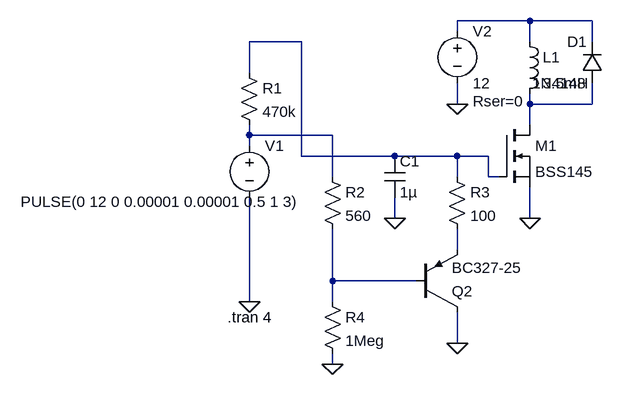
[diagram p0: schematic Draft2.asc]
Draft2.asc, the LTspice schematic file:
Version 4
SHEET 1 880 740
WIRE 288 192 176 192
WIRE 384 192 288 192
WIRE 176 208 176 192
WIRE -64 224 -144 224
WIRE 288 224 288 192
WIRE 384 224 384 192
WIRE -144 272 -144 224
WIRE 176 320 176 288
WIRE 288 320 288 304
WIRE 384 320 384 288
WIRE 384 320 288 320
WIRE 288 352 288 320
WIRE -144 368 -144 352
WIRE -16 368 -144 368
WIRE -144 384 -144 368
WIRE -64 400 -64 224
WIRE 80 400 -64 400
WIRE 176 400 80 400
WIRE 224 400 176 400
WIRE -16 432 -16 368
WIRE 176 432 176 400
WIRE 224 432 224 400
WIRE 240 432 224 432
WIRE 80 496 80 464
WIRE 288 496 288 448
WIRE 176 544 176 512
WIRE -16 592 -16 512
WIRE 112 592 -16 592
WIRE -144 624 -144 464
WIRE -16 624 -16 592
WIRE 176 688 176 640
WIRE -16 720 -16 704
FLAG 288 496 0
FLAG -144 624 0
FLAG 176 320 0
FLAG 80 496 0
FLAG 176 688 0
FLAG -16 720 0
SYMBOL ind 272 208 R0
SYMATTR InstName L1
SYMATTR Value 3.5mH
SYMATTR SpiceLine Rser=580
SYMBOL diode 400 288 R180
WINDOW 0 24 64 Left 2
WINDOW 3 24 0 Left 2
SYMATTR InstName D1
SYMATTR Value 1N4148
SYMBOL voltage -144 368 R0
WINDOW 3 -352 102 Left 2
WINDOW 123 0 0 Left 0
WINDOW 39 0 0 Left 0
SYMATTR InstName V1
SYMATTR Value PULSE(0 12 0 0.00001 0.00001 0.5 1 3)
SYMBOL voltage 176 192 R0
WINDOW 123 0 0 Left 0
WINDOW 39 24 124 Left 2
SYMATTR InstName V2
SYMATTR Value 12
SYMATTR SpiceLine Rser=0
SYMBOL cap 64 400 R0
SYMATTR InstName C1
SYMATTR Value 1µ
SYMBOL res -160 256 R0
SYMATTR InstName R1
SYMATTR Value 470k
SYMBOL pnp 112 640 M180
SYMATTR InstName Q2
SYMATTR Value BC327-25
SYMBOL nmos 240 352 R0
SYMATTR InstName M1
SYMATTR Value BSS145
SYMBOL res -32 416 R0
SYMATTR InstName R2
SYMATTR Value 560
SYMBOL res 160 416 R0
SYMATTR InstName R3
SYMATTR Value 100
SYMBOL res -32 608 R0
SYMATTR InstName R4
SYMATTR Value 1Meg
TEXT -178 648 Left 2 !.tran 4

The netlist it stands for:
* Draft2.asc
L1 N001 N003 3.5mH Rser=580
D1 N003 N001 1N4148
V1 N004 0 PULSE(0 12 0 0.00001 0.00001 0.5 1 3)
V2 N001 0 12 Rser=0
C1 N002 0 1µ
R1 N002 N004 470k
Q2 0 N006 N005 0 BC327-25
M1 N003 N002 0 0 BSS145
R2 N004 N006 560
R3 N002 N005 100
R4 N006 0 1Meg
.model D D
.lib standard.dio
.model NPN NPN
.model PNP PNP
.lib standard.bjt
.model NMOS NMOS
.model PMOS PMOS
.lib standard.mos
.tran 4
.backanno
.end